# Altium schematic sheet Charger+Main_Power — копия.SchDoc
size 420 x 297 mm
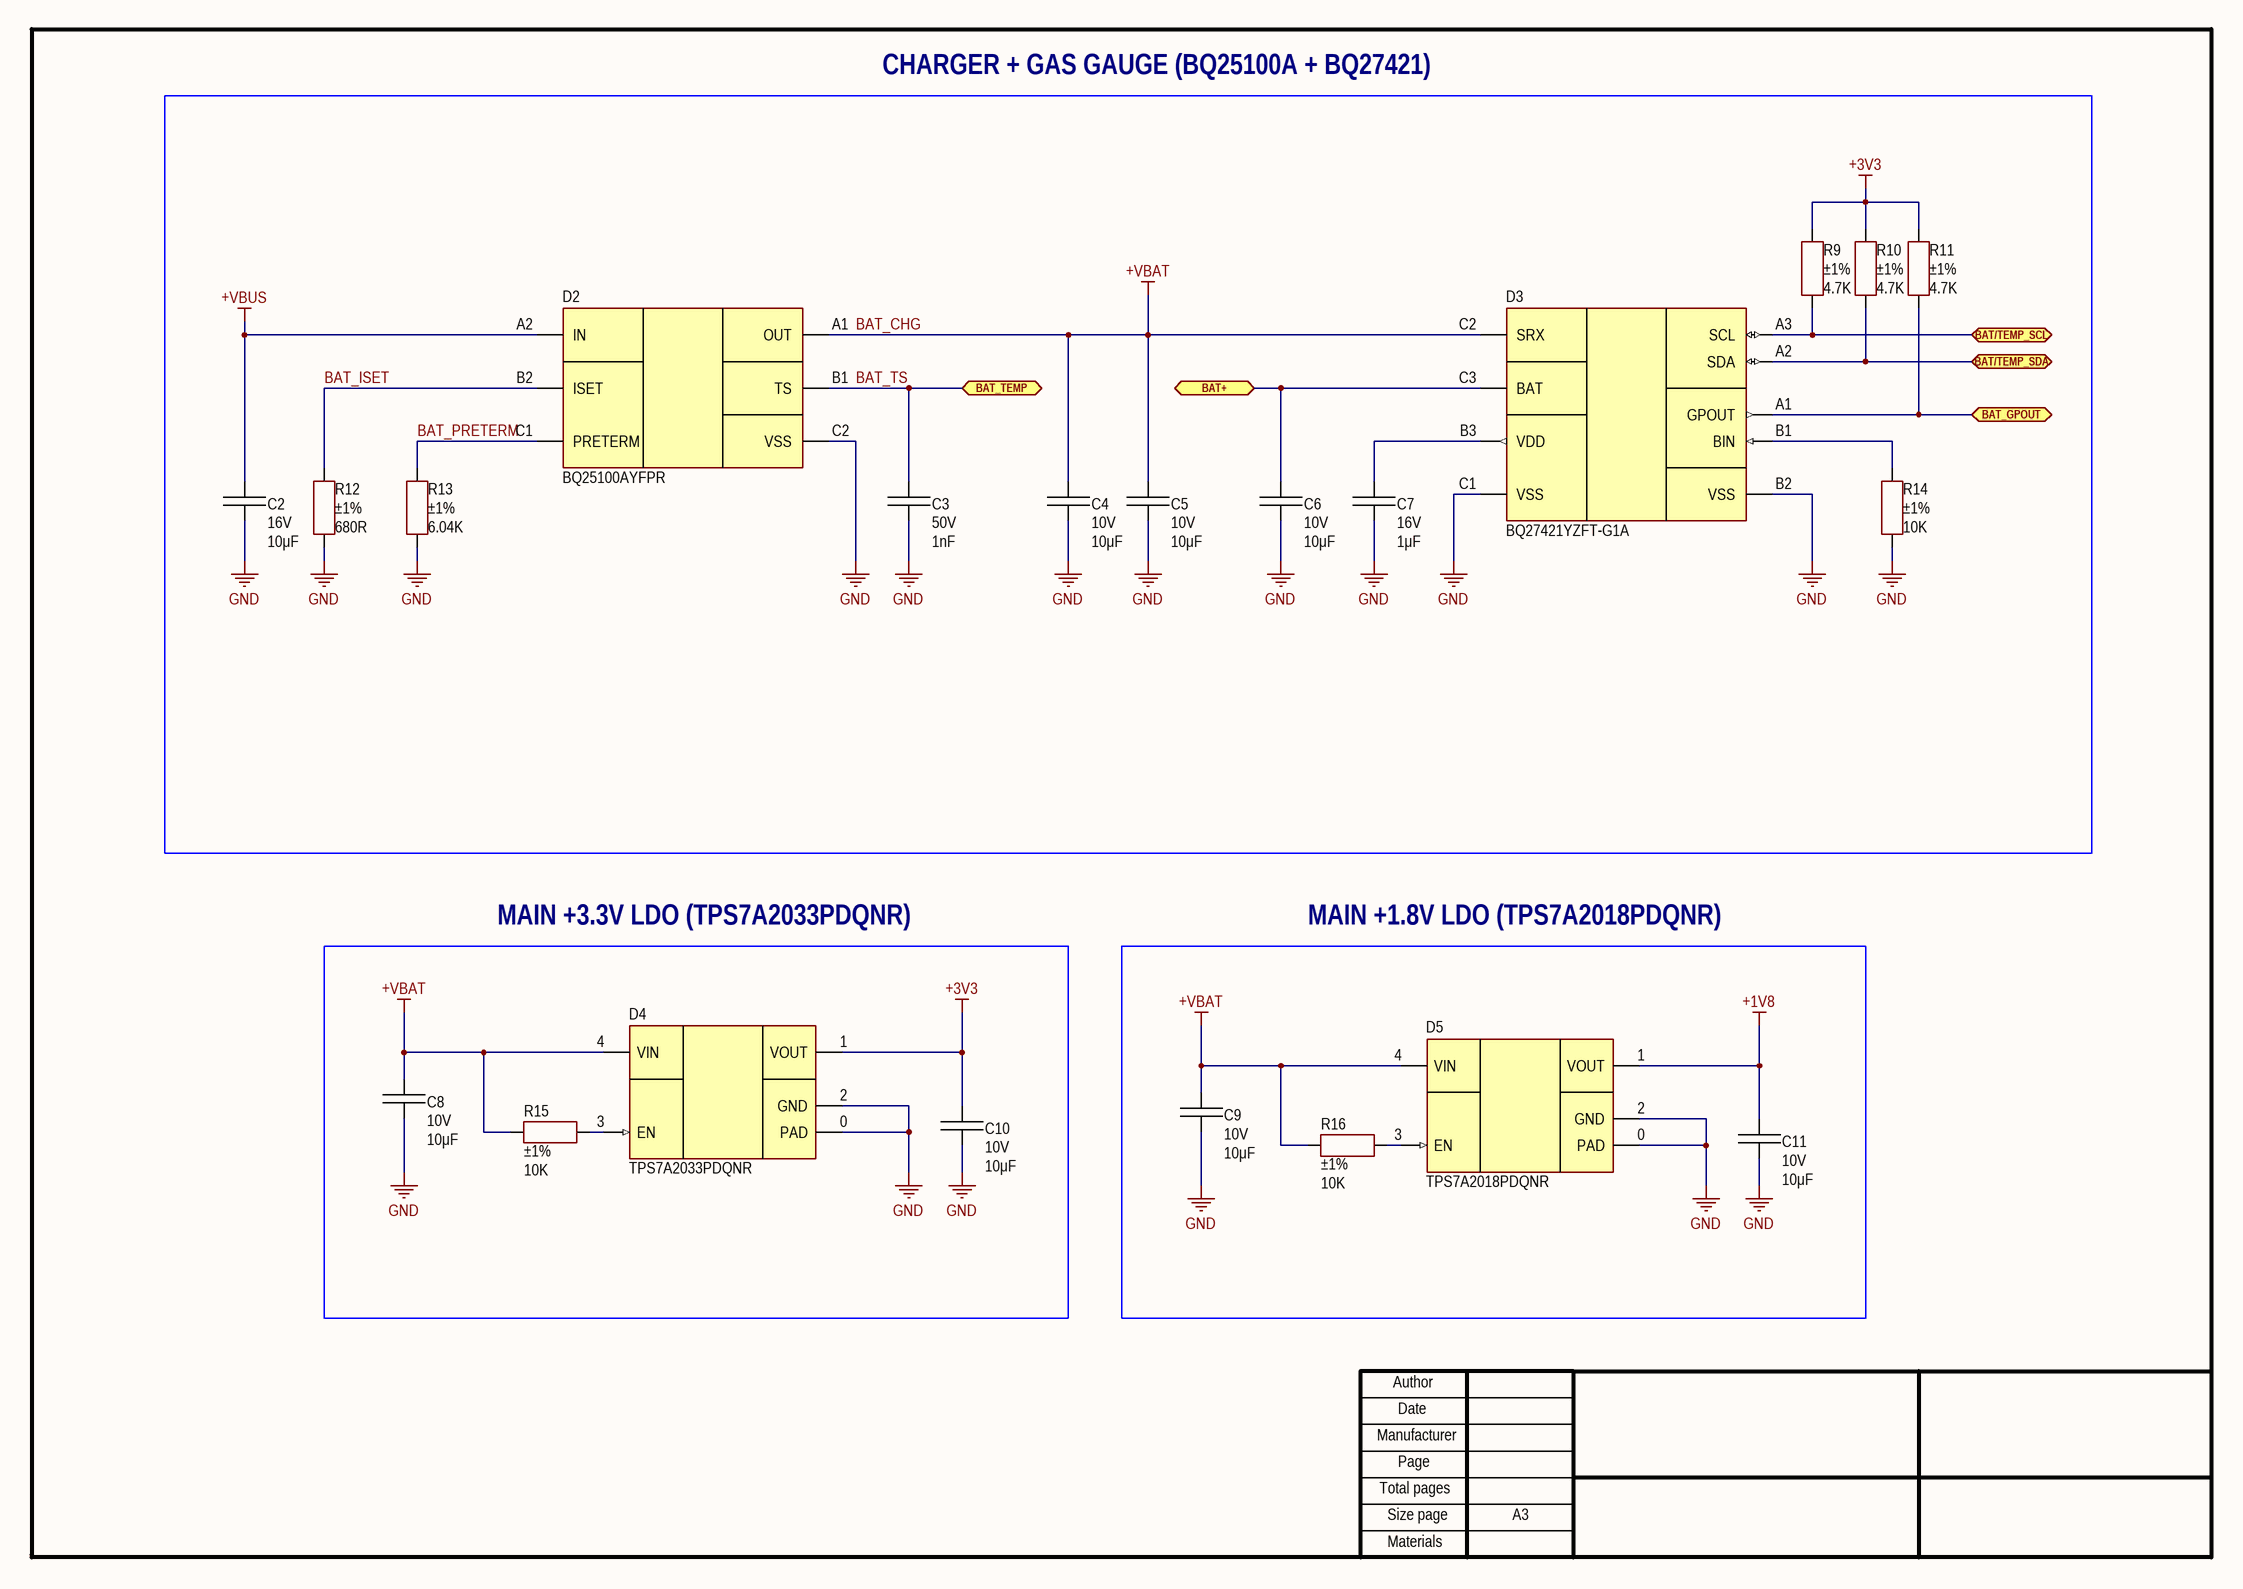
[diagram p0: Charger+Main_Power — копия.SchDoc]

## Parts
C2  value 10μF  Voltage: 16V  [CAP: 0805_NO_SILK]
C3  value 1nF  Voltage: 50V  [CAP: 0805]
C4  value 10μF  Voltage: 10V  [CAP: 0805]
C5  value 10μF  Voltage: 10V  [CAP: 0805]
C6  value 10μF  Voltage: 10V  [CAP: 0805]
C7  value 1μF  Voltage: 16V  [CAP: 0805]
C8  value 10μF  Voltage: 10V  [CAP: 0805]
C9  value 10μF  Voltage: 10V  [CAP: 0805]
C10  value 10μF  Voltage: 10V  [CAP: 0805]
C11  value 10μF  Voltage: 10V  [CAP: 0805]
D2  (no value)  [IC: BQ25100]
D3  PartNumber: BQ27421YZFT-G1A  [IC: 9-DSBGA]
D4  PartNumber: TPS7A2033PDQNR  [IC: 4-X2SON]
D5  PartNumber: TPS7A2018PDQNR  [IC: 4-X2SON]
R9  value 4.7K  Tolerance: ±1%  [RES: 0805]
R10  value 4.7K  Tolerance: ±1%  [RES: 0805]
R11  value 4.7K  Tolerance: ±1%  [RES: 0805]
R12  value 680R  Tolerance: ±1%  [RES: 0805]
R13  value 6.04K  Tolerance: ±1%  [RES: 0805]
R14  value 10K  Tolerance: ±1%  [RES: 0805]
R15  value 10K  Tolerance: ±1%  [RES: 0805]
R16  value 10K  Tolerance: ±1%  [RES: 0805]

## Blocks framed on the sheet
CHARGER + GAS GAUGE (BQ25100A + BQ27421): C2-C7 D2 D3 R9-R14
MAIN +3.3V LDO (TPS7A2033PDQNR): C8 C10 D4 R15
MAIN +1.8V LDO (TPS7A2018PDQNR): C9 C11 D5 R16

## Ports
BAT+ (bidir), BAT/TEMP_SCL (bidir), BAT/TEMP_SDA (bidir), BAT_GPOUT (bidir), BAT_TEMP (bidir)

## Nets
+1V8: C11.2 D5.1(VOUT)
+3V3: C10.2 D4.1(VOUT) R9.1 R10.1 R11.1
+VBUS: C2.2 D2.A2(IN)
BAT_CHG: C4.2 C5.2 C8.2 C9.2 D2.A1(OUT) D3.C2(SRX) D4.4(VIN) D5.4(VIN) R15.2 R16.2  [also labelled +VBAT]
GND: C2.1 C3.1 C4.1 C5.1 C6.1 C7.1 C8.1 C9.1 C10.1 C11.1 D2.C2(VSS) D3.B2(VSS) D3.C1(VSS) D4.0(PAD) D4.2(GND) D5.0(PAD) D5.2(GND) R12.2 R13.2 R14.2
BAT+: C6.2 D3.C3(BAT) ; port BAT+
BAT/TEMP_SCL: D3.A3(SCL) R9.2 ; port BAT/TEMP_SCL
BAT/TEMP_SDA: D3.A2(SDA) R10.2 ; port BAT/TEMP_SDA
BAT_GPOUT: D3.A1(GPOUT) R11.2 ; port BAT_GPOUT
BAT_ISET: D2.B2(ISET) R12.1
BAT_PRETERM: D2.C1(PRETERM) R13.1
BAT_TS: C3.2 D2.B1(TS) ; port BAT_TEMP
NetC7_2: C7.2 D3.B3(VDD)
NetD3_B1: D3.B1(BIN) R14.1
NetD4_3: D4.3(EN) R15.1
NetD5_3: D5.3(EN) R16.1

## Notes on the sheet
- Author
- Manufacturer
- Date
- Page
- Total pages
- Size page
- A3
- Materials

## Library data of the parts
C2 = Ceramic_0805: 10 µF ±20% 16V Ceramic Capacitor X7R 0805 (2012 Metric); Manufacturer: Yageo; PartNumber: CC0805MKX7R7BB106; ValueManufacturerPartNumber: Ceramic capacitor, 10μF, X7R, ±10%, 16V, 0805, -55...+125°C; Tolerance: ±10%; Package: 0805; HelpURL: https://www.digikey.com/en/products/detail/yageo/CC0805MKX7R7BB106/7164392; Temperature: -55...+125°C; TypeCapacitor: Ceramic capacitor; TypeDielectric: X7R
C3 = Ceramic_0805: 1000 pF ±5% 50V Ceramic Capacitor C0G, NP0 0805 (2012 Metric); Manufacturer: Yageo; PartNumber: CC0805JRNPO9BN102; ValueManufacturerPartNumber: Ceramic capacitor, 1nF, NP0, ±5%, 50V, 0805, -55...+125°C; Package: 0805; HelpURL: https://www.digikey.com/en/products/detail/yageo/CC0805JRNPO9BN102/302856; Temperature: -55...+125°C; TypeCapacitor: Ceramic capacitor; Tolerance: ±5%; TypeDielectric: NP0
C4-C6 C8-C11 = Ceramic_0805: 10 µF ±10% 10V Ceramic Capacitor X7R 0805 (2012 Metric); Manufacturer: Yageo; PartNumber: CC0805KFX7R6BB106; ValueManufacturerPartNumber: Ceramic capacitor, 10μF, X7R, ±10%, 10V, 0805, -55...+125°C; Package: 0805; HelpURL: https://www.digikey.com/en/products/detail/yageo/CC0805KFX7R6BB106/11611326; Temperature: -55...+125°C; TypeCapacitor: Ceramic capacitor; Tolerance: ±10%; TypeDielectric: X7R
C7 = Ceramic_0805: 1 µF ±10% 16V Ceramic Capacitor X7R 0805 (2012 Metric); Manufacturer: Yageo; PartNumber: CC0805KKX7R7BB105; ValueManufacturerPartNumber: Ceramic capacitor, 1μF, X7R, ±10%, 16V, 0805, -55...+125°C; Package: 0805; HelpURL: https://www.digikey.com/en/products/detail/yageo/CC0805KKX7R7BB105/2103103; Temperature: -55...+125°C; TypeCapacitor: Ceramic capacitor; Tolerance: ±10%; TypeDielectric: X7R
D2 = BQ25100AYFPR: PMIC; Manufacturer: Texas Instruments; ValueManufacturerPartNumber: PMIC, Li-Ion/Li-Po, 4.45...6.45V, -40...+85°C, 10-WSON; Supply: 4.45...6.45V; HelpURL: https://www.digikey.com/en/products/detail/texas-instruments/BQ25100AYFPR/4977096; Package: 10-WSON; ComponentType: PMIC; Temperature: -40...+85°C; Standard: Li-Ion/Li-Po; PartNumber: BQ25100AYFPR
D3 = BQ25100AYFPR_1: Gas gauge; Manufacturer: Texas Instruments; ValueManufacturerPartNumber: Gas gauge, Li-Ion, 2.45...4.5V, -40...+85°C, 9-DSBGA; Supply: 2.45...4.5V; HelpURL: https://www.digikey.com/en/products/detail/texas-instruments/BQ27421YZFT-G1A/4212801; Package: 9-DSBGA; ComponentType: Gas gauge; Temperature: -40...+85°C; Standard: Li-Ion
D4 = TPS7A2033: Linear voltage regulator; Manufacturer: Texas Instruments; ValueManufacturerPartNumber: Linear voltage regulator, input 3.44...6V, 2V, 3.3V, 0.3A, -40...+125°C, 4-X2SON; VoltageInput: input 3.44...6V; MaxDropout: 2V; CurrentOutput: 0.3A; VoltageOutput: 3.3V; HelpURL: https://www.digikey.com/en/products/detail/texas-instruments/TPS7A2033PDQNR/13245684; Package: 4-X2SON; ComponentType: Linear voltage regulator; Temperature: -40...+125°C
D5 = TPS7A2033: Linear voltage regulator; Manufacturer: Texas Instruments; ValueManufacturerPartNumber: Linear voltage regulator, input 2...6V, 2V, 1.8V, 0.3A, -40...+125°C, 4-X2SON; VoltageInput: input 2...6V; MaxDropout: 2V; CurrentOutput: 0.3A; VoltageOutput: 1.8V; HelpURL: https://www.digikey.com/en/products/detail/texas-instruments/TPS7A2018PDQNR/13245683; Package: 4-X2SON; ComponentType: Linear voltage regulator; Temperature: -40...+125°C
R9-R11 = Resistor_0805: 4.7 kOhms ±5% 0.125W, 1/8W Chip Resistor 0805 (2012 Metric) Moisture Resistant Thick Film; Manufacturer: Yageo; PartNumber: RC0805JR-074K7L; ValueManufacturerPartNumber: Resistor film, 4.7K, ±1%, 0805, 0.125W, -55...+125°C; TypeResistor: Resistor film; Package: 0805; HelpURL: https://www.digikey.com/en/products/detail/yageo/RC0805JR-074K7L/728327; Temperature: -55...+125°C; Power: 0.125W
R12 = Resistor_0805: 680 Ohms ±1% 0.125W, 1/8W Chip Resistor 0805 (2012 Metric) Moisture Resistant Thick Film; Manufacturer: Yageo; PartNumber: RC0805FR-07680RL; ValueManufacturerPartNumber: Resistor film, 680R, ±1%, 0805, 0.125W, -55...+125°C; TypeResistor: Resistor film; Package: 0805; HelpURL: https://www.digikey.com/en/products/detail/yageo/RC0805FR-07680RL/728101; Temperature: -55...+125°C; Power: 0.125W
R13 = Resistor_0805: 6.04 kOhms ±1% 0.125W, 1/8W Chip Resistor 0805 (2012 Metric) Moisture Resistant Thick Film; Manufacturer: Yageo; PartNumber: RC0805FR-076K04L; ValueManufacturerPartNumber: Resistor film, 6.04K, ±1%, 0805, 0.125W, -55...+125°C; TypeResistor: Resistor film; Package: 0805; HelpURL: https://www.digikey.com/en/products/detail/yageo/RC0805FR-076K04L/728049; Temperature: -55...+125°C; Power: 0.125W
R14-R16 = Resistor_0805: 10 kOhms ±1% 0.125W, 1/8W Chip Resistor 0805 (2012 Metric) Moisture Resistant Thick Film; Manufacturer: Yageo; PartNumber: RC0805FR-0710KL; ValueManufacturerPartNumber: Resistor film, 10K, ±1%, 0805, 0.125W, -55...+125°C; TypeResistor: Resistor film; Package: 0805; HelpURL: https://www.digikey.com/en/products/detail/yageo/RC0805FR-0710KL/727535; Temperature: -55...+125°C; Power: 0.125W